# EAGLE schematic ECE445-Transmitter-Schematic-MCU (EAGLE 7.5.0)
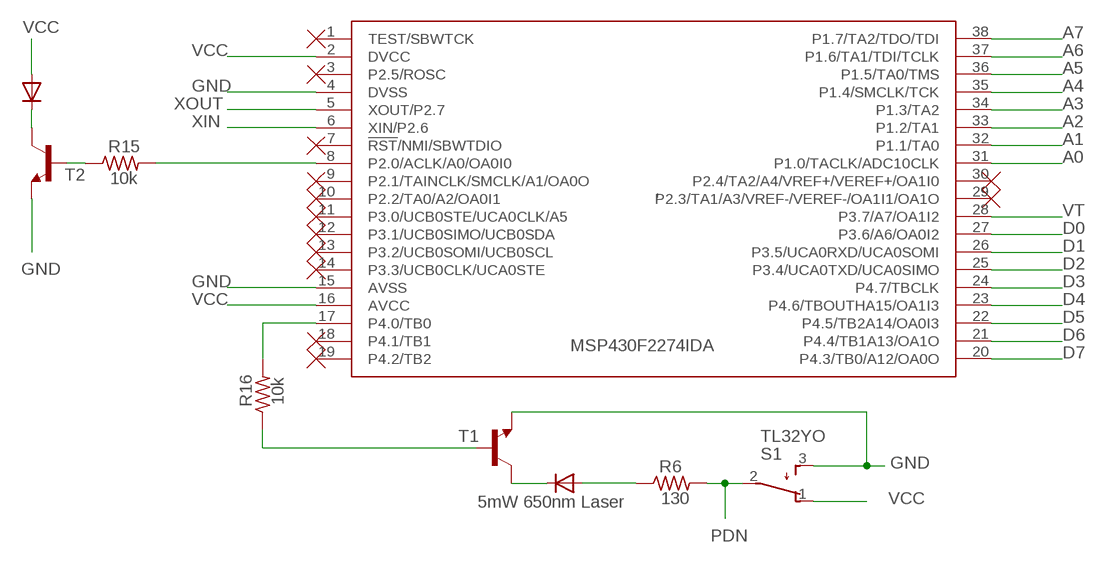
[diagram p0: schematic, sheet 1]

## Parts
-  MSP430F2274IDA  [TSSOP38_R-PDSO-G38-DA]
R6  130  R-US_0204/2V  [0204V]
R15  10k  R-US_0204/2V  [0204V]
R16  10k  R-US_0204/2V  [0204V]
S1  TL32YO  [TL3XYO]
T1  5mW 650nm Laser  2N4923  [TO126]
T2  2N4923  [TO126]
U$1  NO_CONNECT  [NO_CONNECT]
U$3  NO_CONNECT  [NO_CONNECT]
U$4  NO_CONNECT  [NO_CONNECT]
U$5  NO_CONNECT  [NO_CONNECT]
U$6  NO_CONNECT  [NO_CONNECT]
U$7  NO_CONNECT  [NO_CONNECT]
U$8  NO_CONNECT  [NO_CONNECT]
U$9  NO_CONNECT  [NO_CONNECT]
U$10  NO_CONNECT  [NO_CONNECT]
U$11  NO_CONNECT  [NO_CONNECT]
U$12  NO_CONNECT  [NO_CONNECT]
U$13  NO_CONNECT  [NO_CONNECT]
U$14  NO_CONNECT  [NO_CONNECT]

## Nets
A0: -.31(P1.0/TACLK/ADC10CLK)
A1: -.32(P1.1/TA0)
A2: -.33(P1.2/TA1)
A3: -.34(P1.3/TA2)
A4: -.35(P1.4/SMCLK/TCK)
A5: -.36(P1.5/TA0/TMS)
A6: -.37(P1.6/TA1/TDI/TCLK)
A7: -.38(P1.7/TA2/TDO/TDI)
D0: -.27(P3.6/A6/OA0I2)
D1: -.26(P3.5/UCA0RXD/UCA0SOMI)
D2: -.25(P3.4/UCA0TXD/UCA0SIMO)
D3: -.24(P4.7/TBCLK)
D4: -.23(P4.6/TBOUTHA15/OA1I3)
D5: -.22(P4.5/TB2A14/OA0I3)
D6: -.21(P4.4/TB1A13/OA1O)
D7: -.20(P4.3/TB0/A12/OA0O)
GND: -.4(DVSS) -.15(AVSS) S1.3(S) T1.1(E) T2.1(E)
LED_IND: -.8(P2.0/ACLK/A0/OA0I0) R15.2
N$1: -.7(!RST!/NMI/SBWTDIO) U$1.P$1(NC)
N$2: T1.2(C)
N$3: R6.1
N$4: -.17(P4.0/TB0) R16.2
N$5: R15.1 T2.3(B)
N$6: T2.2(C)
N$10: -.9(P2.1/TAINCLK/SMCLK/A1/OA0O) U$3.P$1(NC)
N$11: -.10(P2.2/TA0/A2/OA0I1) U$4.P$1(NC)
N$12: -.11(P3.0/UCB0STE/UCA0CLK/A5) U$5.P$1(NC)
N$13: -.12(P3.1/UCB0SIMO/UCB0SDA) U$6.P$1(NC)
N$14: -.13(P3.2/UCB0SOMI/UCB0SCL) U$7.P$1(NC)
N$15: -.14(P3.3/UCB0CLK/UCA0STE) U$8.P$1(NC)
N$16: -.30(P2.4/TA2/A4/VREF+/VEREF+/OA1I0) U$9.P$1(NC)
N$17: -.29(P2.3/TA1/A3/VREF-/VEREF-/OA1I1/OA1O) U$10.P$1(NC)
N$18: -.18(P4.1/TB1) U$11.P$1(NC)
N$19: -.19(P4.2/TB2) U$12.P$1(NC)
N$20: -.1(TEST/SBWTCK) U$13.P$1(NC)
N$21: -.3(P2.5/ROSC) U$14.P$1(NC)
PDN: S1.2(P)
TTL_LAS: R16.1 T1.3(B)
VCC: -.2(DVCC) -.16(AVCC) S1.1(O)
VT: -.28(P3.7/A7/OA1I2)
XIN: -.6(XIN/P2.6)
XOUT: -.5(XOUT/P2.7)
Unconnected: R6.2

## Library data of the parts
- = texas:MSP430F22*4IDA: MIXED SIGNAL MICROCONTROLLER Source: http://focus.ti.com/lit/ds/symlink/msp430f2274.pdf; MPN: MSP430F2274IDA; OC_FARNELL: 1610179; OC_NEWARK: 28M6350
R6 R15 R16 = rcl:R-US_: RESISTOR, American symbol
S1 = switch:TL32YO: TINY SWITCH ON - MOM Source: http://www2.produktinfo.conrad.com/datenblaetter/700000-724999/705152-da-01-de-Subminiaturschalter_TL_36YO.pdf
T1 T2 = transistor:2N4923: NPN TRANSISTOR
U$1 U$3-U$14 = NO_CONNECT:NO_CONNECT